# Altium project dv_cm.PrjPcb
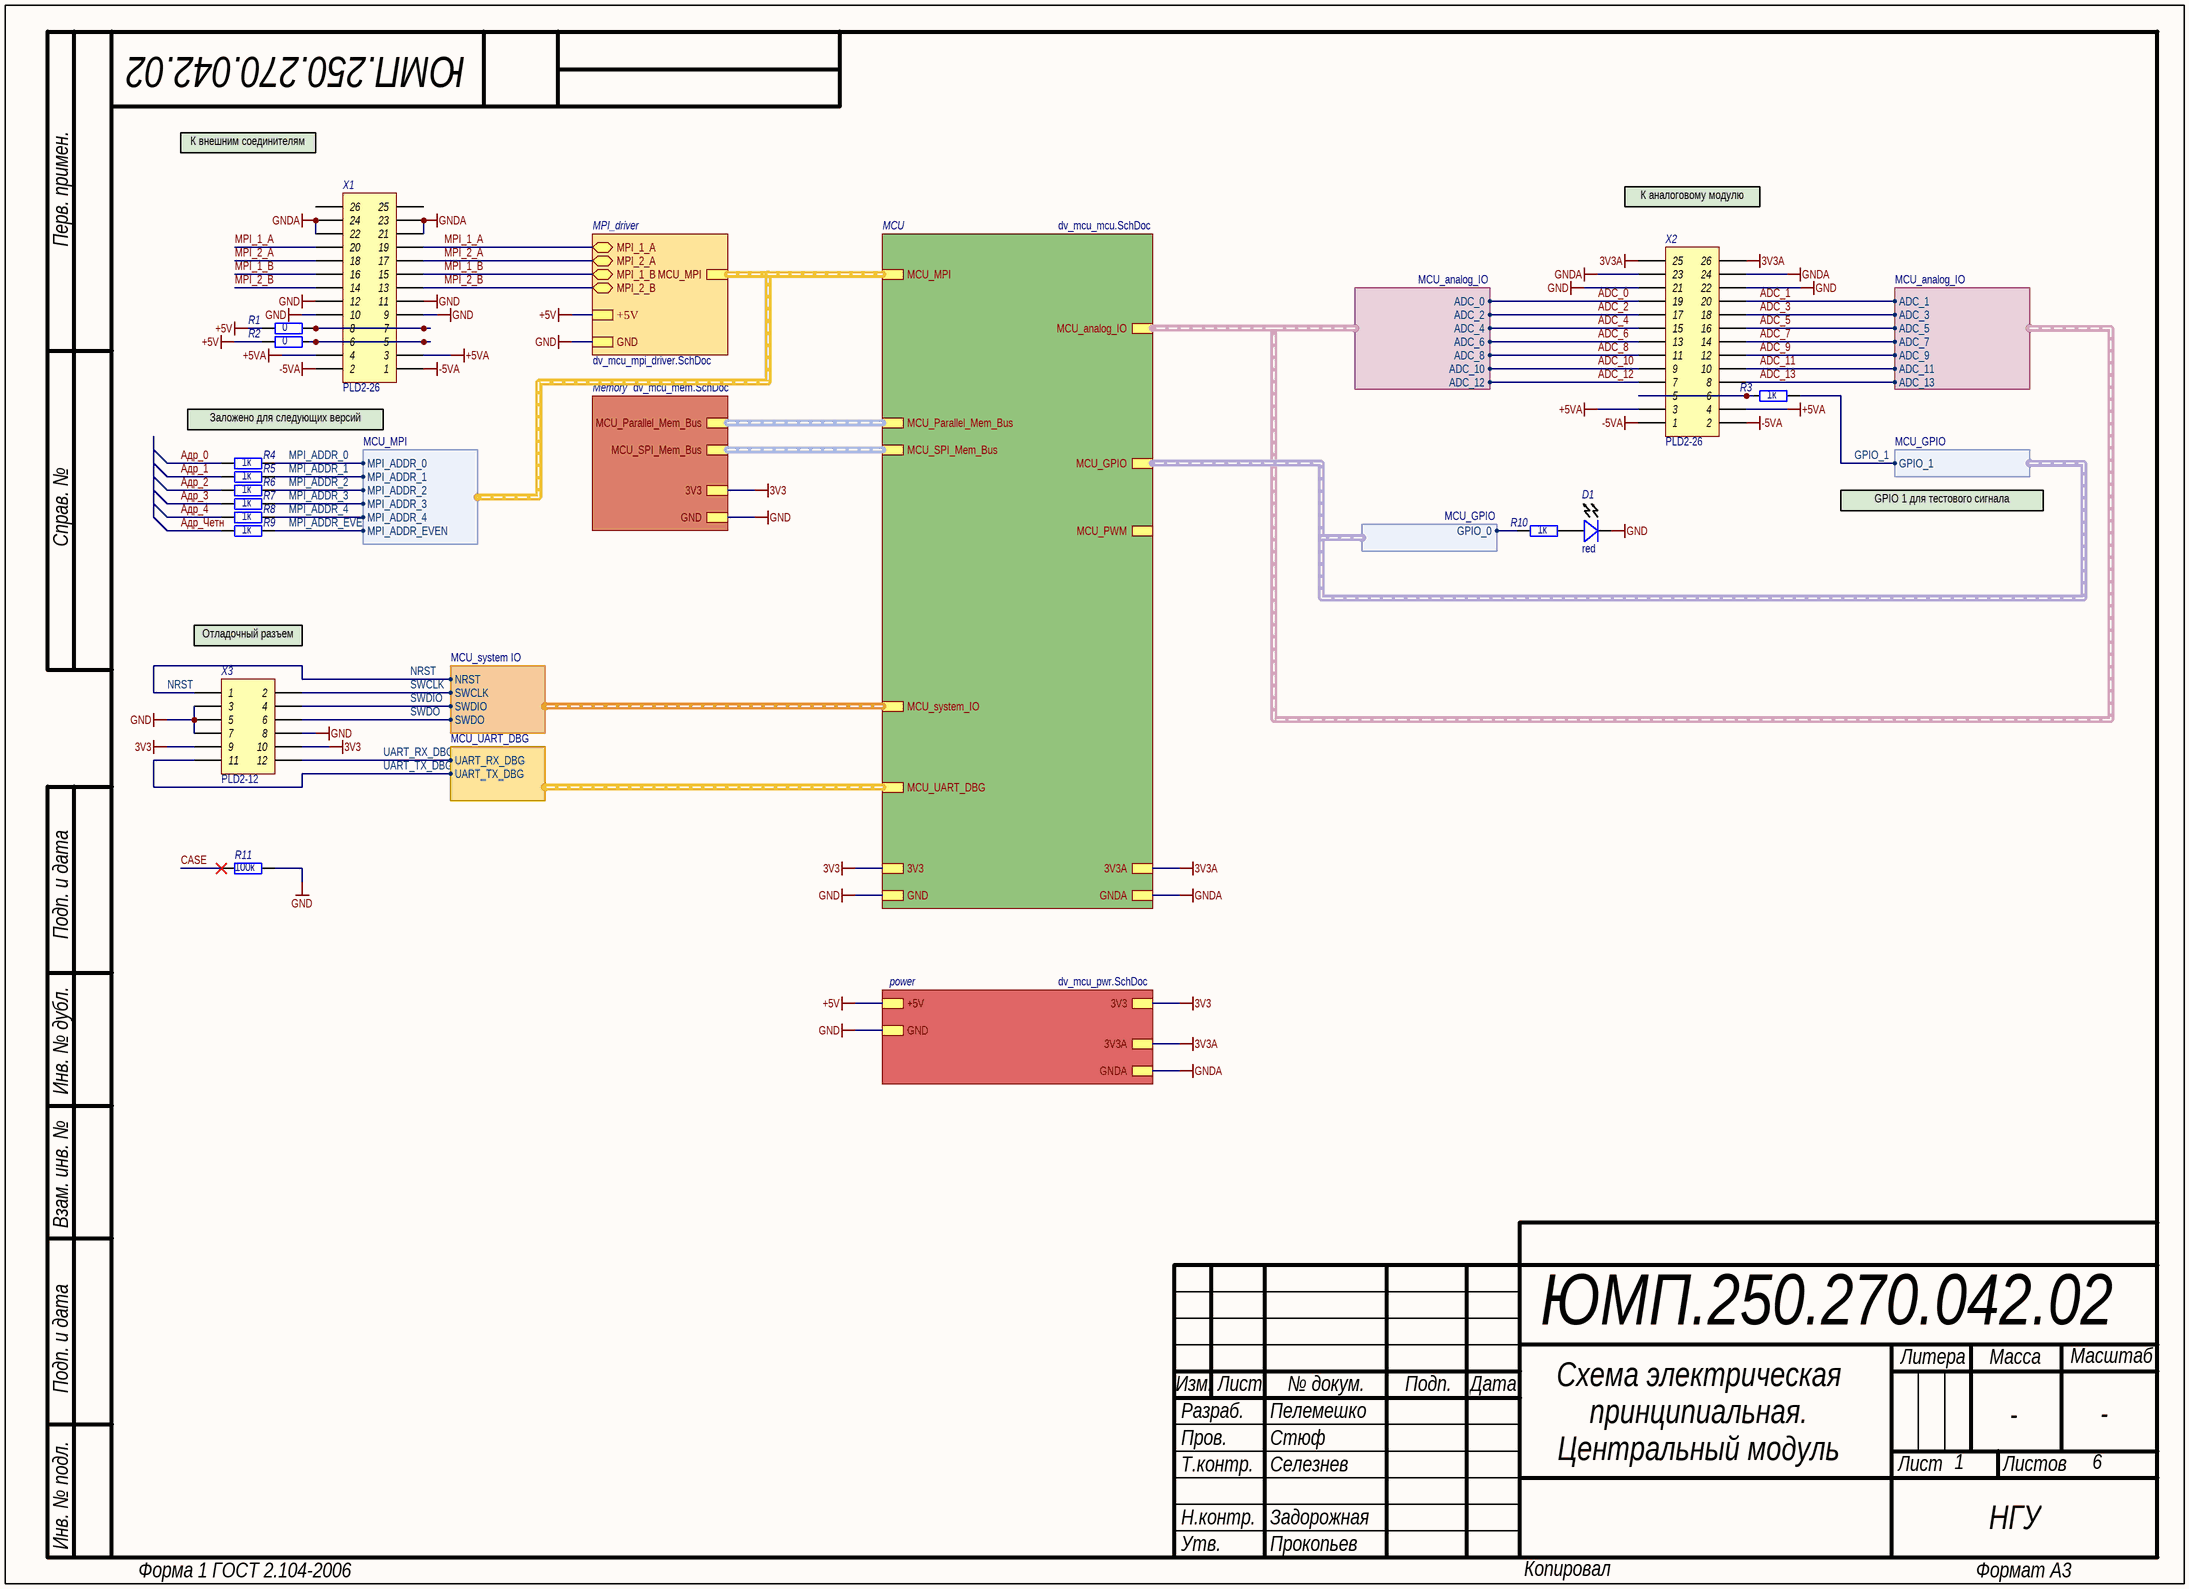
[diagram p0: dv_mcu.SchDoc]
GlobalOrganizationName: НГУ; GlobalProjectName1: Схема электрическая; GlobalProjectName2: принципиальная.; GlobalProjectName3: Центральный модуль; GlobalProjectNumber: ЮМП.250.270.042.02; GlobalProjectRevision: #1.0; Норм.Контр.: Задорожная; Проверил: Стюф; Разработал: Пелемешко; Т.Контр.: Селезнев; Утвердил: Прокопьев
6 sheets, 145 parts. Net scope: hierarchical (ports join the sheet entries above them; power ports are global).
Board file: dv_cm.PcbDoc
Sheets:
  dv_mcu.SchDoc
    MCU = dv_mcu_mcu.SchDoc
      LPF_ADC0 = dv_mcu_analog_lpf.SchDoc
      LPF_ADC1 = dv_mcu_analog_lpf.SchDoc
      LPF_ADC2 = dv_mcu_analog_lpf.SchDoc
      LPF_ADC3 = dv_mcu_analog_lpf.SchDoc
      LPF_ADC4 = dv_mcu_analog_lpf.SchDoc
      LPF_ADC5 = dv_mcu_analog_lpf.SchDoc
      LPF_ADC6 = dv_mcu_analog_lpf.SchDoc
      LPF_ADC7 = dv_mcu_analog_lpf.SchDoc
      LPF_ADC8 = dv_mcu_analog_lpf.SchDoc
      LPF_ADC9 = dv_mcu_analog_lpf.SchDoc
      LPF_ADC10 = dv_mcu_analog_lpf.SchDoc
      LPF_ADC11 = dv_mcu_analog_lpf.SchDoc
      LPF_ADC12 = dv_mcu_analog_lpf.SchDoc
      LPF_ADC13 = dv_mcu_analog_lpf.SchDoc
    Memory = dv_mcu_mem.SchDoc
    MPI_driver = dv_mcu_mpi_driver.SchDoc
    power = dv_mcu_pwr.SchDoc

## Sheet dv_mcu.SchDoc: =GlobalProjectName
size 410 x 297 mm; ApprovedBy: Прокопьев; CheckedBy: Стюф; Author: Пелемешко; Organization: НГУ; DocumentNumber: ЮМП.250.270.042.02 Э3; Revision: #1.0; SheetNumber: 1; SheetTotal: 6; PageSetup: Record=PageOptions|CenterHorizontal=True|CenterVertical=True|PrintScale=1.00|XCorrection=1.00|YCorrection=1.00|PrintKind=1|BorderSize=5000000|LeftOffset=0|BottomOffset=0|Orientation=2|PaperLength=1000|PaperWidth=1000|Scale=100|PaperSource=15|PrintQuality=1200|MediaType=1|DitherType=10|PaperKind=A3|PrintScaleMode=1; Weight: -; ScaleFactor: -; NormInspection: Задорожная; FirstApplication: ЮМП.250.270.042.02

### Parts
D1  value red  [LED-0805]  (hidden comment: LED)
R1  value 0  [SMD_0805]  (hidden comment: OSM R1-12)
R2  value 0  [SMD_0805]  (hidden comment: OSM R1-12)
R3  value 1к  [SMD_0805]  (hidden comment: OSM R1-12)
R4  value 1к  [SMD_0805]  (hidden comment: OSM R1-12)
R5  value 1к  [SMD_0805]  (hidden comment: OSM R1-12)
R6  value 1к  [SMD_0805]  (hidden comment: OSM R1-12)
R7  value 1к  [SMD_0805]  (hidden comment: OSM R1-12)
R8  value 1к  [SMD_0805]  (hidden comment: OSM R1-12)
R9  value 1к  [SMD_0805]  (hidden comment: OSM R1-12)
R10  value 1к  [SMD_0805]  (hidden comment: OSM R1-12)
R11  value 100к  [SMD_0805]  (hidden comment: OSM R1-12)
X1  Наименование: PLD2-26  [SD87340-26]  (hidden comment: Header 2X26)
X2  Наименование: PLD2-26  [SD87340-26]  (hidden comment: Header 2X26)
X3  Header 2X12  [PLD2-12]  (value not drawn)

### Sub-sheets
MCU = dv_mcu_mcu.SchDoc: MCU_GPIO (harness MCU_GPIO), MCU_UART_DBG (harness MCU_UART_DBG), MCU_system_IO (harness MCU_system IO), MCU_Parallel_Mem_Bus (harness MCU_MPI), MCU_MPI (harness MCU_MPI), 3V3, MCU_analog_IO (harness MCU_analog_IO), GND, MCU_SPI_Mem_Bus (harness MCU_SPI_Mem_Bus), MCU_PWM (harness MCU_PWM), 3V3A, GNDA
Memory = dv_mcu_mem.SchDoc: MCU_Parallel_Mem_Bus (harness MCU_MPI), MCU_SPI_Mem_Bus (harness MCU_SPI_Mem_Bus), GND, 3V3
MPI_driver = dv_mcu_mpi_driver.SchDoc: GND, MCU_MPI (harness MCU_MPI), MPI_2_B (bidir), MPI_2_A (bidir), MPI_1_A (bidir), MPI_1_B (bidir), +5V
power = dv_mcu_pwr.SchDoc: 3V3, +5V, 3V3A, GNDA, GND

### Harnesses
MCU_system IO: SWDO, SWDIO, SWCLK, NRST
MCU_UART_DBG: UART_TX_DBG, UART_RX_DBG
MCU_analog_IO: ADC_0, ADC_2, ADC_4, ADC_6, ADC_10, ADC_8, ADC_12
MCU_analog_IO: ADC_1, ADC_3, ADC_5, ADC_7, ADC_11, ADC_9, ADC_13
MCU_MPI: MPI_ADDR_0, MPI_ADDR_1, MPI_ADDR_2, MPI_ADDR_3, MPI_ADDR_4, MPI_ADDR_EVEN
MCU_GPIO: GPIO_1
MCU_GPIO: GPIO_0

### Nets
3V3: X3.9 X3.10 ; sheet MCU/3V3, sheet Memory/3V3, sheet power/3V3
3V3A: X2.25 X2.26 ; sheet MCU/3V3A, sheet power/3V3A
+5V: R1.1 R2.1 ; sheet MPI_driver/+5V, sheet power/+5V
+5VA: X1.3 X1.4 X2.3 X2.4
-5VA: X1.1 X1.2 X2.1 X2.2
GND: D1.2(K) R11.2 X1.9 X1.10 X1.11 X1.12 X1.21 X1.22 X1.23 X1.24 X2.21 X2.22 X2.23 X2.24 X3.3 X3.5 X3.7 X3.8 ; sheet MCU/GND, sheet MCU/GNDA, sheet Memory/GND, sheet MPI_driver/GND, sheet power/GNDA, sheet power/GND  [also labelled GNDA]
ADC_0: X2.19 ; sheet MCU/MCU_analog_IO.ADC_0
ADC_1: X2.20 ; sheet MCU/MCU_analog_IO.ADC_1
ADC_2: X2.17 ; sheet MCU/MCU_analog_IO.ADC_2
ADC_3: X2.18 ; sheet MCU/MCU_analog_IO.ADC_3
ADC_4: X2.15 ; sheet MCU/MCU_analog_IO.ADC_4
ADC_5: X2.16 ; sheet MCU/MCU_analog_IO.ADC_5
ADC_6: X2.13 ; sheet MCU/MCU_analog_IO.ADC_6
ADC_7: X2.14 ; sheet MCU/MCU_analog_IO.ADC_7
ADC_8: X2.11 ; sheet MCU/MCU_analog_IO.ADC_8
ADC_9: X2.12 ; sheet MCU/MCU_analog_IO.ADC_9
ADC_10: X2.9 ; sheet MCU/MCU_analog_IO.ADC_10
ADC_11: X2.10 ; sheet MCU/MCU_analog_IO.ADC_11
ADC_12: X2.7 ; sheet MCU/MCU_analog_IO.ADC_12
ADC_13: X2.8 ; sheet MCU/MCU_analog_IO.ADC_13
CASE: R11.1
GPIO_0: R10.1 ; sheet MCU/MCU_GPIO.GPIO_0
GPIO_1: R3.2 ; sheet MCU/MCU_GPIO.GPIO_1
MPI_1_A: X1.19 X1.20 ; sheet MPI_driver/MPI_1_A
MPI_1_B: X1.15 X1.16 ; sheet MPI_driver/MPI_1_B
MPI_2_A: X1.17 X1.18 ; sheet MPI_driver/MPI_2_A
MPI_2_B: X1.13 X1.14 ; sheet MPI_driver/MPI_2_B
MPI_ADDR_0: R4.2 ; sheet MCU/MCU_MPI.MPI_ADDR_0
MPI_ADDR_1: R5.2 ; sheet MCU/MCU_MPI.MPI_ADDR_1
MPI_ADDR_2: R6.2 ; sheet MCU/MCU_MPI.MPI_ADDR_2
MPI_ADDR_3: R7.2 ; sheet MCU/MCU_MPI.MPI_ADDR_3
MPI_ADDR_4: R8.2 ; sheet MCU/MCU_MPI.MPI_ADDR_4
MPI_ADDR_EVEN: R9.2 ; sheet MCU/MCU_MPI.MPI_ADDR_EVEN
NRST: X3.1 ; sheet MCU/MCU_system_IO.NRST
SWCLK: X3.2 ; sheet MCU/MCU_system_IO.SWCLK
SWDIO: X3.4 ; sheet MCU/MCU_system_IO.SWDIO
SWDO: X3.6 ; sheet MCU/MCU_system_IO.SWDO
UART_RX_DBG: X3.12 ; sheet MCU/MCU_UART_DBG.UART_RX_DBG
UART_TX_DBG: X3.11 ; sheet MCU/MCU_UART_DBG.UART_TX_DBG
Адр_0: R4.1
Адр_1: R5.1
Адр_2: R6.1
Адр_3: R7.1
Адр_4: R8.1
Адр_Четн: R9.1
NetD1_1: D1.1(A) R10.2
NetR1_2: R1.2 X1.7 X1.8
NetR2_2: R2.2 X1.5 X1.6
NetR3_1: R3.1 X2.5 X2.6

Not connected (* = marked no-connect by the designer): X1 25 26

### Buses and harness runs
harness sheet MCU/MCU_MPI = sheet MPI_driver/MCU_MPI
harness sheet MCU/MCU_Parallel_Mem_Bus = sheet Memory/MCU_Parallel_Mem_Bus
harness sheet MCU/MCU_SPI_Mem_Bus = sheet Memory/MCU_SPI_Mem_Bus

### Notes on the sheet
- К внешним соединителям
- К аналоговому модулю
- Заложено для следующих версий
- GPIO 1 для тестового сигнала
- (near X3) Отладочный разъем
- Перв. примен.
- Справ. №
- Подп. и дата
- Инв. № дубл.
- Взам. инв. №
- Изм.
- Разраб.
- Лист
- № докум.
- Подп.
- Дата
- Литера
- Масса
- Масштаб
- Пров.
- Т.контр.
- Листов
- Н.контр.
- Утв.
- Инв. № подл.
- Форма 1 ГОСТ 2.104-2006
- Копировал
- Формат А3

### Library data of the parts
D1 = LED: Назначение: Светодиод; Наименование: SMD-LED; Потребление, Вт: 0,01
R1-R11 = Resistor: Наименование: ОСМ Р1-12; Назначение: SMD-резистор; Потребление, Вт: 0,001; Точность: %
X1 X2 = Header 2X26: Header, 26-Pin, Dual row; Назначение: Header, 20-Pin, Dual row; Потребление, Вт: 0,0
X3 = Header 2X12: Header, 12-Pin, Dual row; Потребление, Вт: 0,0; Назначение: Header, 12-Pin, Dual row; Наименование: PLD2-12

## Sheet dv_mcu_mcu.SchDoc: =GlobalProjectName
size 410 x 297 mm; ApprovedBy: Утвердил; CheckedBy: Проверил; Author: Разработал; Organization: НГУ; DocumentNumber: ЮМП.250.270.042.02 Э3; Revision: #1.0; SheetNumber: 2; SheetTotal: 6; PageSetup: Record=PageOptions|CenterHorizontal=True|CenterVertical=True|PrintScale=1.00|XCorrection=1.00|YCorrection=1.00|PrintKind=1|BorderSize=5000000|LeftOffset=0|BottomOffset=0|Orientation=2|PaperLength=1000|PaperWidth=1000|Scale=100|PaperSource=15|PrintQuality=1200|MediaType=1|DitherType=10|PaperKind=A3|PrintScaleMode=1; Weight: -; ScaleFactor: -; NormInspection: Норм.Контр.; FirstApplication: ЮМП.250.270.042.02; Time: Листов
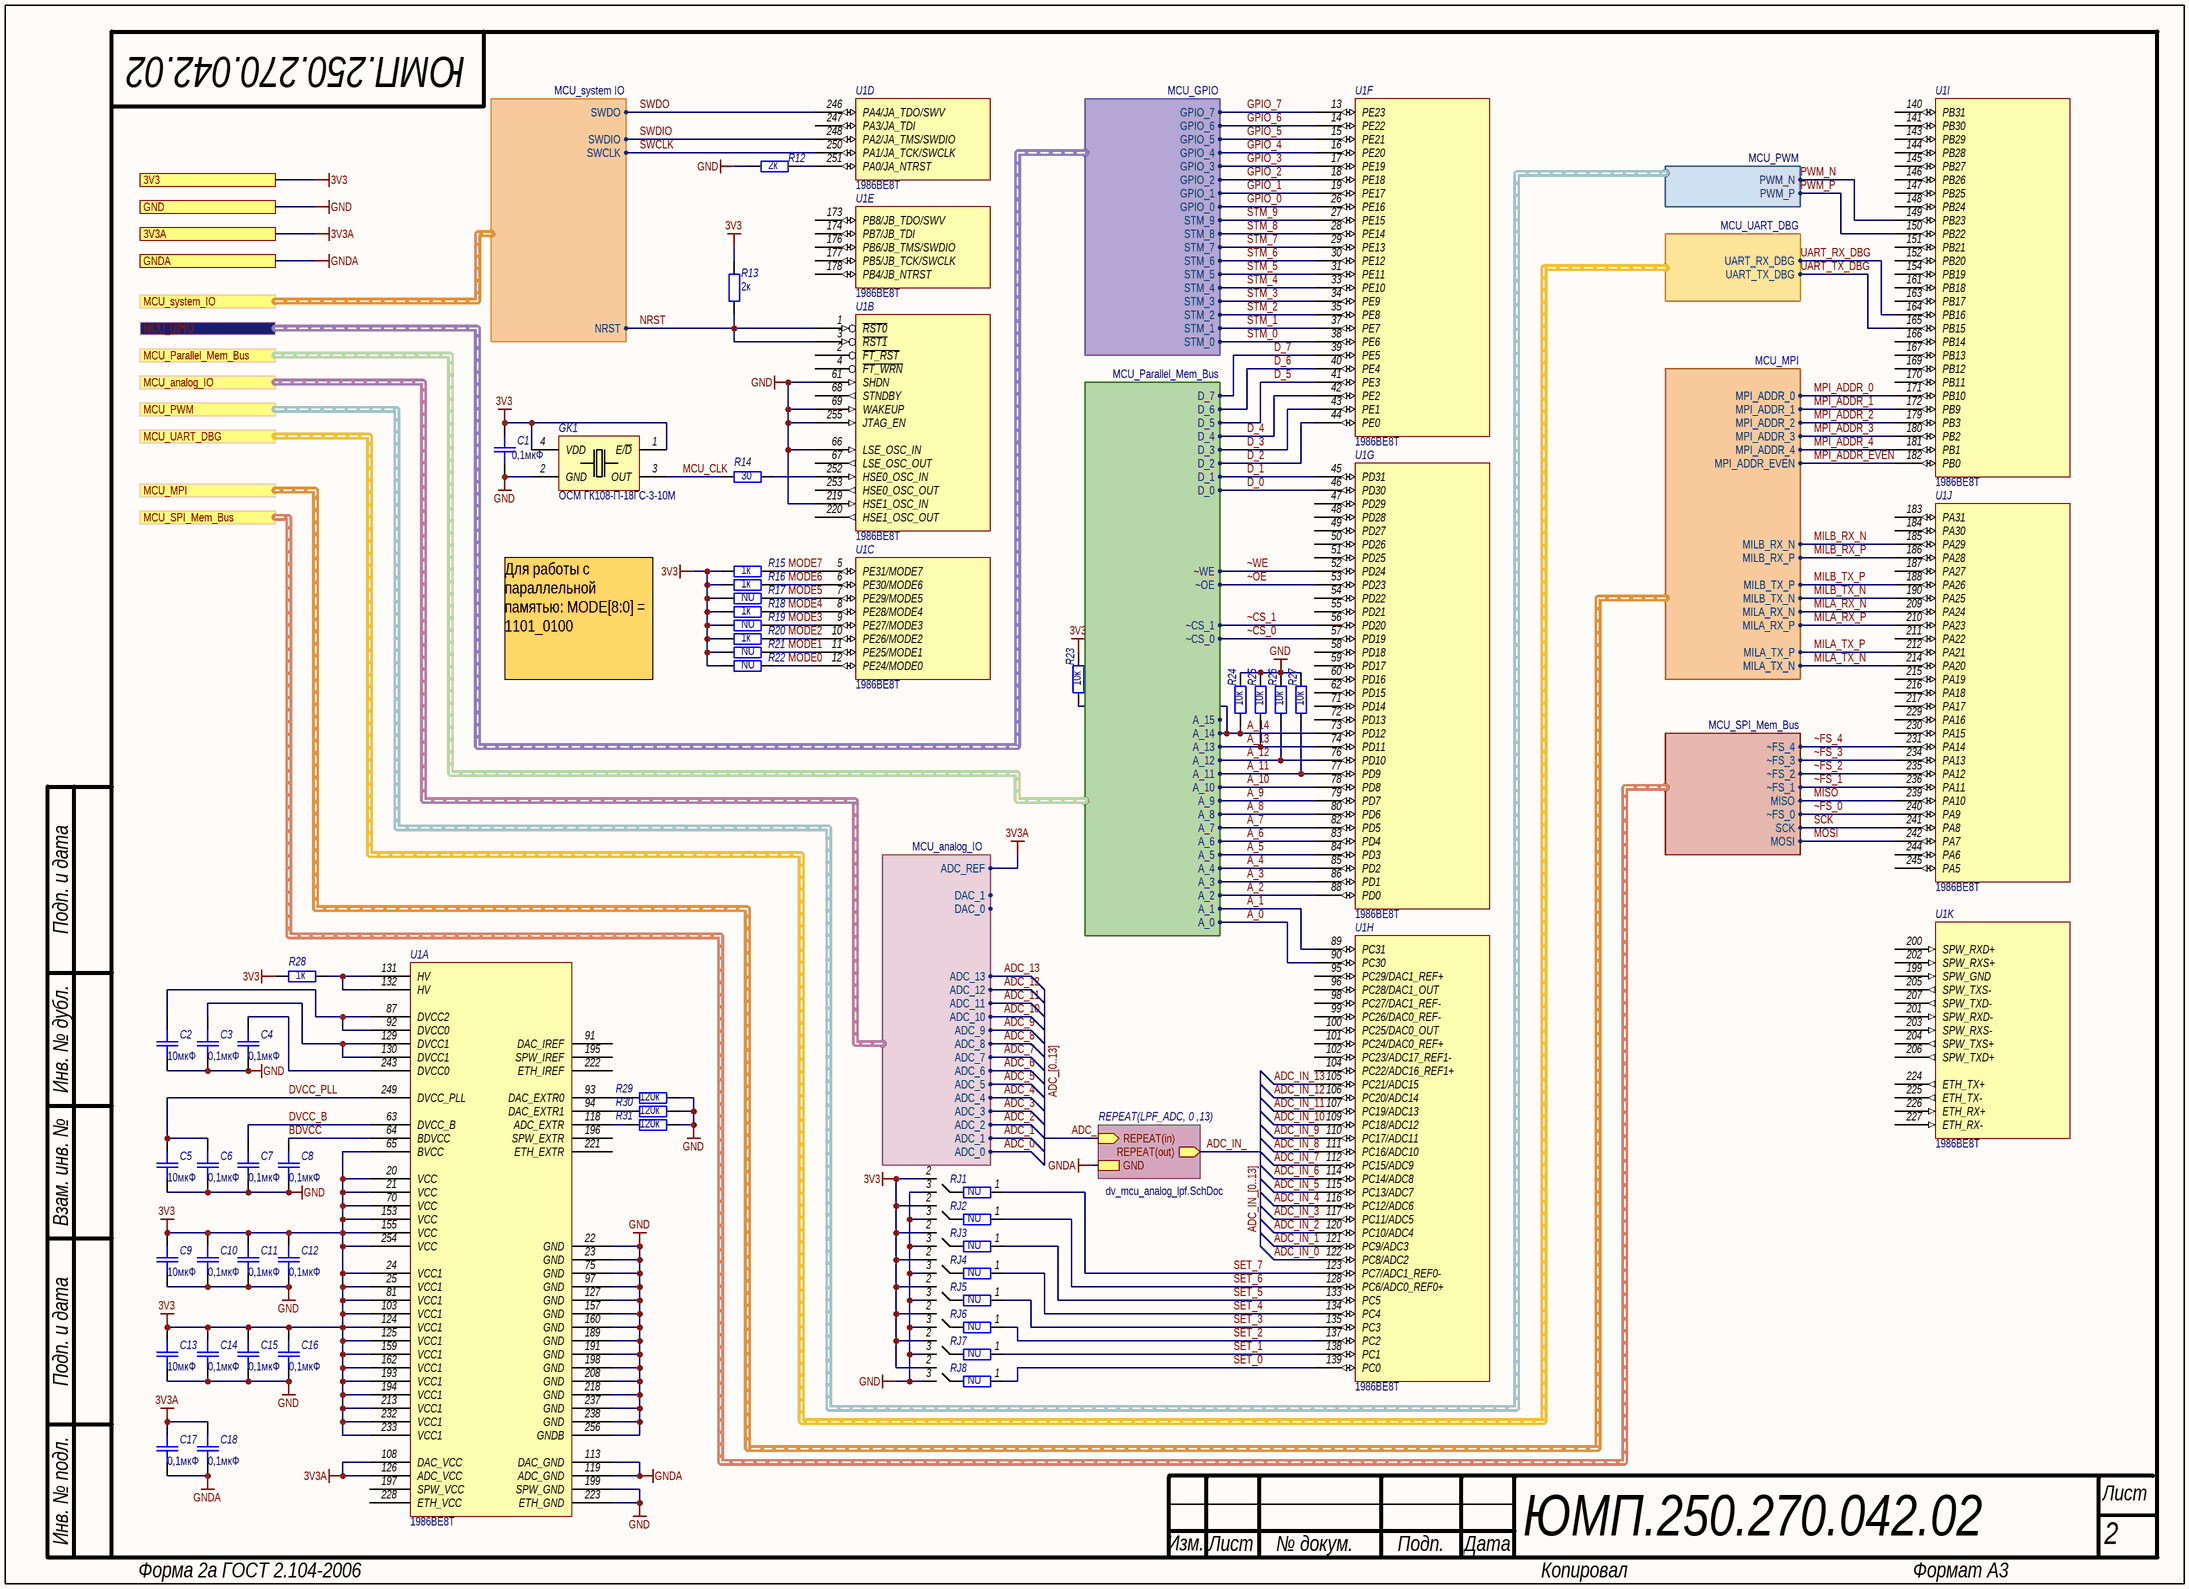
[diagram p1: dv_mcu_mcu.SchDoc]

### Parts
C1  value 0,1мкФ  [SMD_C0805]  (hidden comment: K10-79)
C2  value 10мкФ  [SMD_C0805]  (hidden comment: K10-79)
C3  value 0,1мкФ  [SMD_C0805]  (hidden comment: K10-79)
C4  value 0,1мкФ  [SMD_C0805]  (hidden comment: K10-79)
C5  value 10мкФ  [SMD_C0805]  (hidden comment: K10-79)
C6  value 0,1мкФ  [SMD_C0805]  (hidden comment: K10-79)
C7  value 0,1мкФ  [SMD_C0805]  (hidden comment: K10-79)
C8  value 0,1мкФ  [SMD_C0805]  (hidden comment: K10-79)
C9  value 10мкФ  [SMD_C0805]  (hidden comment: K10-79)
C10  value 0,1мкФ  [SMD_C0805]  (hidden comment: K10-79)
C11  value 0,1мкФ  [SMD_C0805]  (hidden comment: K10-79)
C12  value 0,1мкФ  [SMD_C0805]  (hidden comment: K10-79)
C13  value 10мкФ  [SMD_C0805]  (hidden comment: K10-79)
C14  value 0,1мкФ  [SMD_C0805]  (hidden comment: K10-79)
C15  value 0,1мкФ  [SMD_C0805]  (hidden comment: K10-79)
C16  value 0,1мкФ  [SMD_C0805]  (hidden comment: K10-79)
C17  value 0,1мкФ  [SMD_C0805]  (hidden comment: K10-79)
C18  value 0,1мкФ  [SMD_C0805]  (hidden comment: K10-79)
GK1  Наименование: ОСМ ГК108-П-18ГС-3-10М  [SMD_7050_Crystal_Oscillator]  (hidden comment: GK108)
R12  value 2к  [SMD_0805]  (hidden comment: OSM R1-12)
R13  value 2к  [SMD_0805]  (hidden comment: OSM R1-12)
R14  value 30  [SMD_0805]  (hidden comment: OSM R1-12)
R15  value 1к  [SMD_0805]  (hidden comment: OSM R1-12)
R16  value 1к  [SMD_0805]  (hidden comment: OSM R1-12)
R17  value NU  [SMD_0805]  (hidden comment: OSM R1-12)
R18  value 1к  [SMD_0805]  (hidden comment: OSM R1-12)
R19  value NU  [SMD_0805]  (hidden comment: OSM R1-12)
R20  value 1к  [SMD_0805]  (hidden comment: OSM R1-12)
R21  value NU  [SMD_0805]  (hidden comment: OSM R1-12)
R22  value NU  [SMD_0805]  (hidden comment: OSM R1-12)
R23  value 10к  [SMD_0805]  (hidden comment: OSM R1-12)
R24  value 10к  [SMD_0805]  (hidden comment: OSM R1-12)
R25  value 10к  [SMD_0805]  (hidden comment: OSM R1-12)
R26  value 10к  [SMD_0805]  (hidden comment: OSM R1-12)
R27  value 10к  [SMD_0805]  (hidden comment: OSM R1-12)
R28  value 1к  [SMD_0805]  (hidden comment: OSM R1-12)
R29  value 120к  [SMD_0805]  (hidden comment: OSM R1-12)
R30  value 120к  [SMD_0805]  (hidden comment: OSM R1-12)
R31  value 120к  [SMD_0805]  (hidden comment: OSM R1-12)
RJ1  NU  [SMD_JMP_0402]
RJ2  NU  [SMD_JMP_0402]
RJ3  NU  [SMD_JMP_0402]
RJ4  NU  [SMD_JMP_0402]
RJ5  NU  [SMD_JMP_0402]
RJ6  NU  [SMD_JMP_0402]
RJ7  NU  [SMD_JMP_0402]
RJ8  NU  [SMD_JMP_0402]
U1  1986VE8T  [4244.256-3]  (value not drawn)  (parts A,B,C,D,E,F,G,H,I,J,K of 11)

### Sub-sheets
REPEAT(LPF_ADC, 0 ,13) = dv_mcu_analog_lpf.SchDoc: REPEAT(in) (in), REPEAT(out) (out), GND

### Ports
3V3, 3V3A, GND, GNDA, MCU_analog_IO (harness MCU_analog_IO), MCU_GPIO (harness MCU_GPIO), MCU_MPI (harness MCU_MPI), MCU_Parallel_Mem_Bus (harness MCU_Parallel_Mem_Bus), MCU_PWM (harness MCU_PWM), MCU_SPI_Mem_Bus (harness MCU_SPI_Mem_Bus), MCU_system_IO (harness MCU_system IO), MCU_UART_DBG (harness MCU_UART_DBG)

### Harnesses
MCU_system IO: SWDO, SWDIO, SWCLK, NRST
MCU_analog_IO: ADC_0, ADC_1, ADC_2, ADC_3, ADC_4, ADC_5, ADC_6, ADC_7, ADC_8, ADC_9, DAC_0, DAC_1, ADC_REF, ADC_10, ADC_11, ADC_12, ADC_13
MCU_Parallel_Mem_Bus: D_0, D_7, D_1, D_2, D_3, D_4, D_5, D_6, A_0, ~CS_0, A_1, A_2, A_3, A_4, A_5, A_6, A_7, A_8, A_9, A_10, A_11, A_12, A_13, A_14, A_15, ~OE, ~WE, ~CS_1
MCU_GPIO: GPIO_0, GPIO_1, GPIO_2, GPIO_3, GPIO_4, GPIO_5, GPIO_6, GPIO_7, STM_9, STM_8, STM_7, STM_6, STM_5, STM_4, STM_3, STM_2, STM_1, STM_0
MCU_UART_DBG: UART_TX_DBG, UART_RX_DBG
MCU_MPI: MILB_RX_N, MILB_RX_P, MILB_TX_P, MILB_TX_N, MILA_RX_N, MILA_RX_P, MILA_TX_P, MILA_TX_N, MPI_ADDR_0, MPI_ADDR_1, MPI_ADDR_2, MPI_ADDR_3, MPI_ADDR_4, MPI_ADDR_EVEN
MCU_SPI_Mem_Bus: ~FS_4, MISO, ~FS_0, SCK, MOSI, ~FS_1, ~FS_2, ~FS_3
MCU_PWM: PWM_N, PWM_P

### Nets
3V3: C1.2 C9.2 C10.2 C11.2 C12.2 C13.2 C14.2 C15.2 C16.2 GK1.1(E/~{D}) GK1.4(VDD) R13.2 R15.1 R16.1 R17.1 R18.1 R19.1 R20.1 R21.1 R22.1 R23.2 R28.1 RJ1.2 RJ2.2 RJ3.2 RJ4.2 RJ5.2 RJ6.2 RJ7.2 RJ8.2 U1.20(VCC) U1.21(VCC) U1.24(VCC1) U1.25(VCC1) U1.65(BVCC) U1.70(VCC) U1.81(VCC1) U1.103(VCC1) U1.124(VCC1) U1.125(VCC1) U1.153(VCC) U1.155(VCC) U1.159(VCC1) U1.162(VCC1) U1.193(VCC1) U1.194(VCC1) U1.213(VCC1) U1.232(VCC1) U1.233(VCC1) U1.254(VCC) ; port 3V3
3V3A: C17.2 C18.2 U1.108(DAC_VCC) U1.126(ADC_VCC) ; port 3V3A, port MCU_analog_IO.ADC_REF
GND: C1.1 C2.1 C3.1 C4.1 C5.1 C6.1 C7.1 C8.1 C9.1 C10.1 C11.1 C12.1 C13.1 C14.1 C15.1 C16.1 C17.1 C18.1 GK1.2(GND) R12.1 R24.2 R25.2 R26.2 R27.2 R29.2 R30.2 R31.2 RJ1.3 RJ2.3 RJ3.3 RJ4.3 RJ5.3 RJ6.3 RJ7.3 RJ8.3 U1.22(GND) U1.23(GND) U1.61(SHDN) U1.66(LSE_OSC_IN) U1.69(WAKEUP) U1.75(GND) U1.97(GND) U1.113(DAC_GND) U1.119(ADC_GND) U1.127(GND) U1.157(GND) U1.160(GND) U1.189(GND) U1.191(GND) U1.198(GND) U1.199(SPW_GND) U1.208(GND) U1.218(GND) U1.219(HSE1_OSC_IN) U1.223(ETH_GND) U1.237(GND) U1.238(GND) U1.255(JTAG_EN) U1.256(GNDB) ; port GND, port GNDA, sheet REPEAT(LPF_ADC, 0 ,13)/GND  [also labelled GNDA]
A_0: U1.90(PC30) ; port MCU_Parallel_Mem_Bus.A_0
A_1: U1.89(PC31) ; port MCU_Parallel_Mem_Bus.A_1
A_2: U1.88(PD0) ; port MCU_Parallel_Mem_Bus.A_2
A_3: U1.86(PD1) ; port MCU_Parallel_Mem_Bus.A_3
A_4: U1.85(PD2) ; port MCU_Parallel_Mem_Bus.A_4
A_5: U1.84(PD3) ; port MCU_Parallel_Mem_Bus.A_5
A_6: U1.83(PD4) ; port MCU_Parallel_Mem_Bus.A_6
A_7: U1.82(PD5) ; port MCU_Parallel_Mem_Bus.A_7
A_8: U1.80(PD6) ; port MCU_Parallel_Mem_Bus.A_8
A_9: U1.79(PD7) ; port MCU_Parallel_Mem_Bus.A_9
A_10: U1.78(PD8) ; port MCU_Parallel_Mem_Bus.A_10
A_11: R27.1 U1.77(PD9) ; port MCU_Parallel_Mem_Bus.A_11
A_12: R26.1 U1.76(PD10) ; port MCU_Parallel_Mem_Bus.A_12
A_13: R25.1 U1.74(PD11) ; port MCU_Parallel_Mem_Bus.A_13
A_14: R23.1 R24.1 U1.73(PD12) ; port MCU_Parallel_Mem_Bus.A_14
ADC_: sheet REPEAT(LPF_ADC, 0 ,13)/REPEAT(in)
ADC_IN_: sheet REPEAT(LPF_ADC, 0 ,13)/REPEAT(out)
ADC_IN_0: U1.122(PC8/ADC2)
ADC_IN_1: U1.121(PC9/ADC3)
ADC_IN_2: U1.120(PC10/ADC4)
ADC_IN_3: U1.117(PC11/ADC5)
ADC_IN_4: U1.116(PC12/ADC6)
ADC_IN_5: U1.115(PC13/ADC7)
ADC_IN_6: U1.114(PC14/ADC8)
ADC_IN_7: U1.112(PC15/ADC9)
ADC_IN_8: U1.111(PC16/ADC10)
ADC_IN_9: U1.110(PC17/ADC11)
ADC_IN_10: U1.109(PC18/ADC12)
ADC_IN_11: U1.107(PC19/ADC13)
ADC_IN_12: U1.106(PC20/ADC14)
ADC_IN_13: U1.105(PC21/ADC15)
BDVCC: C8.2 U1.64(BDVCC)
D_0: U1.46(PD30) ; port MCU_Parallel_Mem_Bus.D_0
D_1: U1.45(PD31) ; port MCU_Parallel_Mem_Bus.D_1
D_2: U1.44(PE0) ; port MCU_Parallel_Mem_Bus.D_2
D_3: U1.43(PE1) ; port MCU_Parallel_Mem_Bus.D_3
D_4: U1.42(PE2) ; port MCU_Parallel_Mem_Bus.D_4
D_5: U1.41(PE3) ; port MCU_Parallel_Mem_Bus.D_5
D_6: U1.40(PE4) ; port MCU_Parallel_Mem_Bus.D_6
D_7: U1.39(PE5) ; port MCU_Parallel_Mem_Bus.D_7
DVCC_B: C7.2 U1.63(DVCC_B)
DVCC_PLL: C5.2 C6.2 U1.249(DVCC_PLL)
GPIO_0: U1.26(PE16) ; port MCU_GPIO.GPIO_0
GPIO_1: U1.19(PE17) ; port MCU_GPIO.GPIO_1
GPIO_2: U1.18(PE18) ; port MCU_GPIO.GPIO_2
GPIO_3: U1.17(PE19) ; port MCU_GPIO.GPIO_3
GPIO_4: U1.16(PE20) ; port MCU_GPIO.GPIO_4
GPIO_5: U1.15(PE21) ; port MCU_GPIO.GPIO_5
GPIO_6: U1.14(PE22) ; port MCU_GPIO.GPIO_6
GPIO_7: U1.13(PE23) ; port MCU_GPIO.GPIO_7
MCU_CLK: GK1.3(OUT) R14.1
MILA_RX_N: U1.209(PA24) ; port MCU_MPI.MILA_RX_N
MILA_RX_P: U1.210(PA23) ; port MCU_MPI.MILA_RX_P
MILA_TX_N: U1.214(PA20) ; port MCU_MPI.MILA_TX_N
MILA_TX_P: U1.212(PA21) ; port MCU_MPI.MILA_TX_P
MILB_RX_N: U1.185(PA29) ; port MCU_MPI.MILB_RX_N
MILB_RX_P: U1.186(PA28) ; port MCU_MPI.MILB_RX_P
MILB_TX_N: U1.190(PA25) ; port MCU_MPI.MILB_TX_N
MILB_TX_P: U1.188(PA26) ; port MCU_MPI.MILB_TX_P
MISO: U1.239(PA10) ; port MCU_SPI_Mem_Bus.MISO
MODE0: R22.2 U1.12(PE24/MODE0)
MODE1: R21.2 U1.11(PE25/MODE1)
MODE2: R20.2 U1.10(PE26/MODE2)
MODE3: R19.2 U1.9(PE27/MODE3)
MODE4: R18.2 U1.8(PE28/MODE4)
MODE5: R17.2 U1.7(PE29/MODE5)
MODE6: R16.2 U1.6(PE30/MODE6)
MODE7: R15.2 U1.5(PE31/MODE7)
MOSI: U1.242(PA7) ; port MCU_SPI_Mem_Bus.MOSI
MPI_ADDR_0: U1.171(PB10) ; port MCU_MPI.MPI_ADDR_0
MPI_ADDR_1: U1.172(PB9) ; port MCU_MPI.MPI_ADDR_1
MPI_ADDR_2: U1.179(PB3) ; port MCU_MPI.MPI_ADDR_2
MPI_ADDR_3: U1.180(PB2) ; port MCU_MPI.MPI_ADDR_3
MPI_ADDR_4: U1.181(PB1) ; port MCU_MPI.MPI_ADDR_4
MPI_ADDR_EVEN: U1.182(PB0) ; port MCU_MPI.MPI_ADDR_EVEN
NRST: R13.1 U1.1(~{RST0}) U1.3(~{RST1}) ; port MCU_system_IO.NRST
PWM_N: U1.149(PB23) ; port MCU_PWM.PWM_N
PWM_P: U1.150(PB22) ; port MCU_PWM.PWM_P
SCK: U1.241(PA8) ; port MCU_SPI_Mem_Bus.SCK
SET_0: RJ8.1 U1.139(PC0)
SET_1: RJ7.1 U1.138(PC1)
SET_2: RJ6.1 U1.137(PC2)
SET_3: RJ5.1 U1.135(PC3)
SET_4: RJ4.1 U1.134(PC4)
SET_5: RJ3.1 U1.133(PC5)
SET_6: RJ2.1 U1.128(PC6/ADC0_REF0+)
SET_7: RJ1.1 U1.123(PC7/ADC1_REF0-)
STM_0: U1.38(PE6) ; port MCU_GPIO.STM_0
STM_1: U1.37(PE7) ; port MCU_GPIO.STM_1
STM_2: U1.35(PE8) ; port MCU_GPIO.STM_2
STM_3: U1.34(PE9) ; port MCU_GPIO.STM_3
STM_4: U1.33(PE10) ; port MCU_GPIO.STM_4
STM_5: U1.31(PE11) ; port MCU_GPIO.STM_5
STM_6: U1.30(PE12) ; port MCU_GPIO.STM_6
STM_7: U1.29(PE13) ; port MCU_GPIO.STM_7
STM_8: U1.28(PE14) ; port MCU_GPIO.STM_8
STM_9: U1.27(PE15) ; port MCU_GPIO.STM_9
SWCLK: U1.250(PA1/JA_TCK/SWCLK) ; port MCU_system_IO.SWCLK
SWDIO: U1.248(PA2/JA_TMS/SWDIO) ; port MCU_system_IO.SWDIO
SWDO: U1.246(PA4/JA_TDO/SWV) ; port MCU_system_IO.SWDO
UART_RX_DBG: U1.164(PB16) ; port MCU_UART_DBG.UART_RX_DBG
UART_TX_DBG: U1.165(PB15) ; port MCU_UART_DBG.UART_TX_DBG
~CS_0: U1.57(PD19) ; port MCU_Parallel_Mem_Bus.~CS_0
~CS_1: U1.56(PD20) ; port MCU_Parallel_Mem_Bus.~CS_1
~FS_0: U1.240(PA9) ; port MCU_SPI_Mem_Bus.~FS_0
~FS_1: U1.236(PA11) ; port MCU_SPI_Mem_Bus.~FS_1
~FS_2: U1.235(PA12) ; port MCU_SPI_Mem_Bus.~FS_2
~FS_3: U1.234(PA13) ; port MCU_SPI_Mem_Bus.~FS_3
~FS_4: U1.231(PA14) ; port MCU_SPI_Mem_Bus.~FS_4
~OE: U1.53(PD23) ; port MCU_Parallel_Mem_Bus.~OE
~WE: U1.52(PD24) ; port MCU_Parallel_Mem_Bus.~WE
NetC2_2: C2.2 U1.87(DVCC2) U1.92(DVCC0)
NetC3_2: C3.2 U1.129(DVCC1) U1.130(DVCC1)
NetC4_2: C4.2 U1.243(DVCC0)
NetR12_2: R12.2 U1.251(PA0/JA_NTRST)
NetR14_2: R14.2 U1.252(HSE0_OSC_IN)
NetR28_2: R28.2 U1.131(HV) U1.132(HV)
NetR29_1: R29.1 U1.93(DAC_EXTR0)
NetR30_1: R30.1 U1.94(DAC_EXTR1)
NetR31_1: R31.1 U1.118(ADC_EXTR)

Not connected (* = marked no-connect by the designer): U1 2(~{FT_RST}) 4(~{FT_WRN}) 47(PD29) 48(PD28) 49(PD27) 50(PD26) 51(PD25) 54(PD22) 55(PD21) 58(PD18) 59(PD17) 60(PD16) 62(PD15) 67(LSE_OSC_OUT) 68(STNDBY) 71(PD14) 72(PD13) 91(DAC_IREF) 95(PC29/DAC1_REF+) 96(PC28/DAC1_OUT) 98(PC27/DAC1_REF-) 99(PC26/DAC0_REF-) 100(PC25/DAC0_OUT) 101(PC24/DAC0_REF+) 102(PC23/ADC17_REF1-) 104(PC22/ADC16_REF1+) 140(PB31) 141(PB30) 143(PB29) 144(PB28) 145(PB27) 146(PB26) 147(PB25) 148(PB24) 151(PB21) 152(PB20) 154(PB19) 161(PB18) 163(PB17) 166(PB14) 167(PB13) 169(PB12) 170(PB11) 173(PB8/JB_TDO/SWV) 174(PB7/JB_TDI) 176(PB6/JB_TMS/SWDIO) 177(PB5/JB_TCK/SWCLK) 178(PB4/JB_NTRST) 183(PA31) 184(PA30) 187(PA27) 195(SPW_IREF) 196(SPW_EXTR) 197(SPW_VCC) 200(SPW_RXD+) 201(SPW_RXD-) 202(SPW_RXS+) 203(SPW_RXS-) 204(SPW_TXS+) 205(SPW_TXS-) 206(SPW_TXD+) 207(SPW_TXD-) 211(PA22) 215(PA19) 216(PA18) 217(PA17) 220(HSE1_OSC_OUT) 221(ETH_EXTR) 222(ETH_IREF) 224(ETH_TX+) 225(ETH_TX-) 226(ETH_RX+) 227(ETH_RX-) 228(ETH_VCC) 229(PA16) 230(PA15) 244(PA6) 245(PA5) 247(PA3/JA_TDI) 253(HSE0_OSC_OUT)

### Buses and harness runs
bus ADC_[0..13]
bus ADC_IN_[0..13]

### Notes on the sheet
- Для работы с параллельной памятью: MODE[8:0] = 1101_0100
- Подп. и дата
- Инв. № дубл.
- Взам. инв. №
- Инв. № подл.
- Изм.
- Лист
- № докум.
- Подп.
- Дата
- Форма 2а ГОСТ 2.104-2006
- Копировал
- Формат А3

### Library data of the parts
C1-C18 = Capacitor: Назначение: SMD-конденсатор; Наименование: К10-79; Потребление, Вт: 0; Напряжение: В; Точность: %
GK1 = Crystal_Oscillator: Crystall oscillator, CMOS, 3.3V, SMD7050; Назначение: Кварцевый генератор; Потребление, Вт: 0,165; ComponentLink1Description: DataSheet; ComponentLink1URL: http://www.lit-phonon.ru/downloads/GK108-P.pdf
R12-R31 = Resistor: as R1 on sheet dv_mcu
RJ1-RJ8 = Resistor_Jamper: Resistor-Jumper; Назначение: Резистор для выбора режима; Наименование: Р1-12-0.125 ОСМ; Потребление, Вт: 0,0; Value: NU
U1 = 1986BE8T: ARM CortexM4F микроконтроллер; Назначение: АРМ микроконтроллер; Потребление, Вт: *; ComponentLink1Description: DataSheet; ComponentLink1URL: https://ic.milandr.ru/upload/iblock/62c/62ca58d6ede1a3e06d56be1e19dbdbc8.pdf; ComponentLink2Description: Errata; ComponentLink2URL: https://ic.milandr.ru/upload/iblock/379/379105061a67e6dd9373b458eff4ec3a.pdf; Наименование: 1986BE8T

## Sheet dv_mcu_analog_lpf.SchDoc: =GlobalProjectName
size 209 x 297 mm; ApprovedBy: Утвердил; CheckedBy: Проверил; Author: Разработал; Organization: НГУ; DocumentNumber: ЮМП.250.270.042.02 Э3; Revision: #1.0; SheetNumber: 3; SheetTotal: 6; PageSetup: Record=PageOptions|CenterHorizontal=True|CenterVertical=True|PrintScale=1.00|XCorrection=1.00|YCorrection=1.00|PrintKind=1|BorderSize=5000000|LeftOffset=0|BottomOffset=0|Orientation=2|PaperLength=1000|PaperWidth=1000|Scale=100|PaperSource=15|PrintQuality=1200|MediaType=1|DitherType=10|PaperKind=A3|PrintScaleMode=1; Weight: -; ScaleFactor: -; NormInspection: Норм.Контр.; FirstApplication: ЮМП.250.270.042.02
Used 14 times, as channels MCU/LPF_ADC0, MCU/LPF_ADC1, MCU/LPF_ADC2, MCU/LPF_ADC3, MCU/LPF_ADC4, MCU/LPF_ADC5, MCU/LPF_ADC6, MCU/LPF_ADC7, MCU/LPF_ADC8, MCU/LPF_ADC9, MCU/LPF_ADC10, MCU/LPF_ADC11, MCU/LPF_ADC12, MCU/LPF_ADC13. Parts and nets are listed once, with the designators drawn on the sheet.
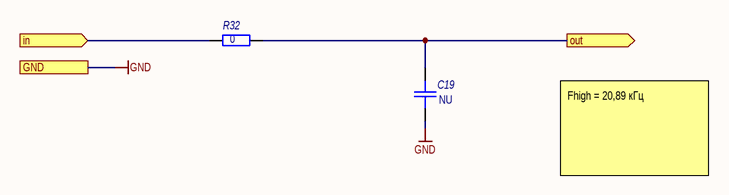
[diagram p2: dv_mcu_analog_lpf.SchDoc]

### Parts
C19  value NU  [SMD_C0805]  (hidden comment: K10-79)
R32  value 0  [SMD_0805]  (hidden comment: OSM R1-12)

### Ports
GND, in (in), out (out)

### Nets
GND: C19.1 ; port GND
in: R32.1 ; port in
out: C19.2 R32.2 ; port out

### Channels
MCU/LPF_ADC0: designators end in _LPF_ADC0; ports GND=GND in=ADC_0 out=ADC_IN_0
MCU/LPF_ADC1: designators end in _LPF_ADC1; ports GND=GND in=ADC_1 out=ADC_IN_1
MCU/LPF_ADC2: designators end in _LPF_ADC2; ports GND=GND in=ADC_2 out=ADC_IN_2
MCU/LPF_ADC3: designators end in _LPF_ADC3; ports GND=GND in=ADC_3 out=ADC_IN_3
MCU/LPF_ADC4: designators end in _LPF_ADC4; ports GND=GND in=ADC_4 out=ADC_IN_4
MCU/LPF_ADC5: designators end in _LPF_ADC5; ports GND=GND in=ADC_5 out=ADC_IN_5
MCU/LPF_ADC6: designators end in _LPF_ADC6; ports GND=GND in=ADC_6 out=ADC_IN_6
MCU/LPF_ADC7: designators end in _LPF_ADC7; ports GND=GND in=ADC_7 out=ADC_IN_7
MCU/LPF_ADC8: designators end in _LPF_ADC8; ports GND=GND in=ADC_8 out=ADC_IN_8
MCU/LPF_ADC9: designators end in _LPF_ADC9; ports GND=GND in=ADC_9 out=ADC_IN_9
MCU/LPF_ADC10: designators end in _LPF_ADC10; ports GND=GND in=ADC_10 out=ADC_IN_10
MCU/LPF_ADC11: designators end in _LPF_ADC11; ports GND=GND in=ADC_11 out=ADC_IN_11
MCU/LPF_ADC12: designators end in _LPF_ADC12; ports GND=GND in=ADC_12 out=ADC_IN_12
MCU/LPF_ADC13: designators end in _LPF_ADC13; ports GND=GND in=ADC_13 out=ADC_IN_13

### Notes on the sheet
- Fhigh = 20,89 кГц
- Подп. и дата
- Инв. № дубл.
- Взам. инв. №
- Инв. № подл.
- Изм.
- Лист
- № докум.
- Подп.
- Дата
- Форма 2а ГОСТ 2.104-2006
- Копировал
- Формат А4

### Library data of the parts
C19 = Capacitor: as C1 on sheet dv_mcu_mcu
R32 = Resistor: as R1 on sheet dv_mcu

## Sheet dv_mcu_mem.SchDoc: =GlobalProjectName
size 209 x 297 mm; ApprovedBy: Утвердил; CheckedBy: Проверил; Author: Разработал; Organization: НГУ; DocumentNumber: ЮМП.250.270.042.02 Э3; Revision: #1.0; SheetNumber: 4; SheetTotal: 6; PageSetup: Record=PageOptions|CenterHorizontal=True|CenterVertical=True|PrintScale=1.00|XCorrection=1.00|YCorrection=1.00|PrintKind=1|BorderSize=5000000|LeftOffset=0|BottomOffset=0|Orientation=2|PaperLength=1000|PaperWidth=1000|Scale=100|PaperSource=15|PrintQuality=1200|MediaType=1|DitherType=10|PaperKind=A3|PrintScaleMode=1; Weight: -; ScaleFactor: -; NormInspection: Норм.Контр.; FirstApplication: ЮМП.250.270.042.02
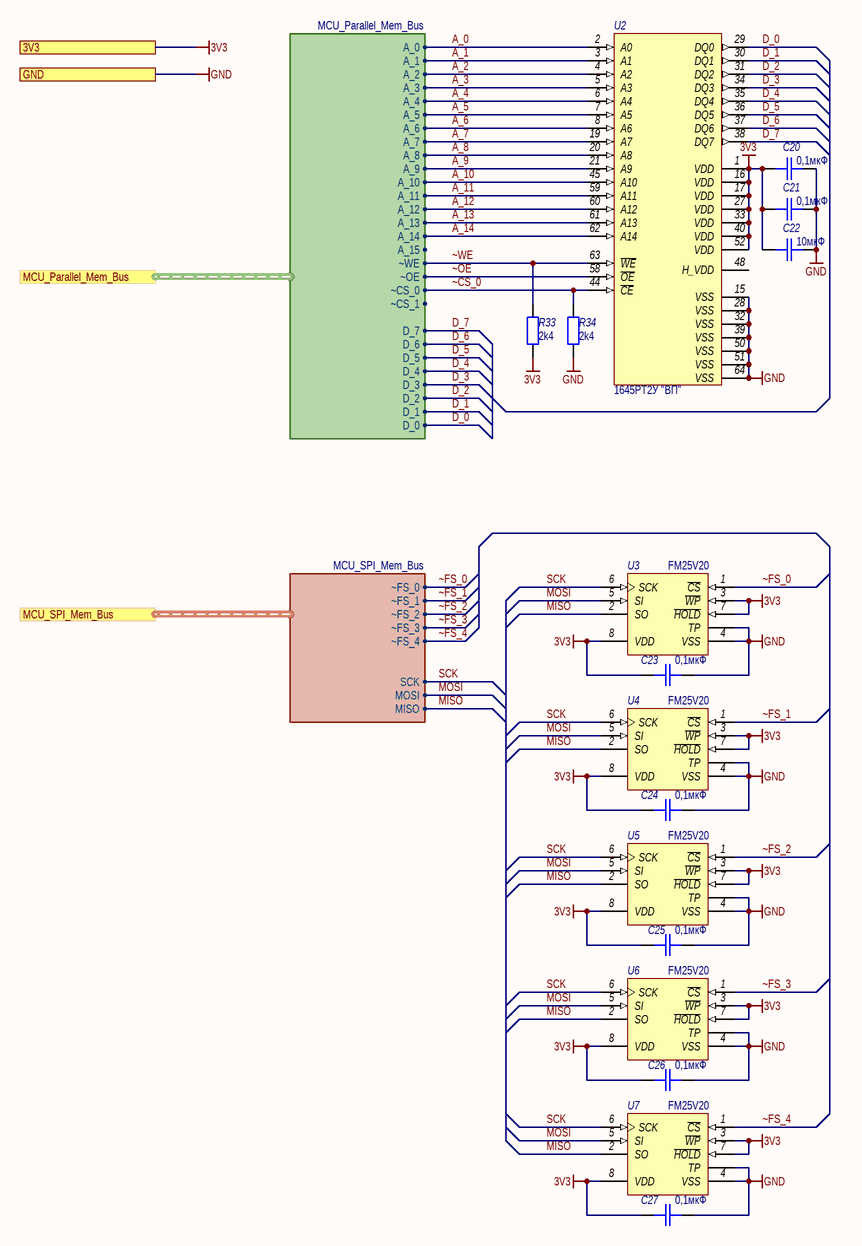
[diagram p3: dv_mcu_mem.SchDoc]

### Parts
C20  value 0,1мкФ  [SMD_C0805]  (hidden comment: K10-79)
C21  value 0,1мкФ  [SMD_C0805]  (hidden comment: K10-79)
C22  value 10мкФ  [SMD_C0805]  (hidden comment: K10-79)
C23  value 0,1мкФ  [SMD_C0805]  (hidden comment: K10-79)
C24  value 0,1мкФ  [SMD_C0805]  (hidden comment: K10-79)
C25  value 0,1мкФ  [SMD_C0805]  (hidden comment: K10-79)
C26  value 0,1мкФ  [SMD_C0805]  (hidden comment: K10-79)
C27  value 0,1мкФ  [SMD_C0805]  (hidden comment: K10-79)
R33  value 2k4  [SMD_0805]  (hidden comment: OSM R1-12)
R34  value 2k4  [SMD_0805]  (hidden comment: OSM R1-12)
U2  Наименование: 1645РТ2У "ВП"  [5134.64-6]  (hidden comment: 1645RT2U VP)
U3  FM25V20  [TDFN-8_6x5]
U4  FM25V20  [TDFN-8_6x5]
U5  FM25V20  [TDFN-8_6x5]
U6  FM25V20  [TDFN-8_6x5]
U7  FM25V20  [TDFN-8_6x5]

### Ports
3V3, GND, MCU_Parallel_Mem_Bus (harness MCU_Parallel_Mem_Bus), MCU_SPI_Mem_Bus (harness MCU_SPI_Mem_Bus)

### Harnesses
MCU_Parallel_Mem_Bus: D_0, ~CS_0, ~OE, ~WE, ~CS_1, D_1, D_2, D_7, D_3, D_4, D_5, D_6, A_0, A_1, A_2, A_3, A_4, A_5, A_6, A_7, A_8, A_9, A_10, A_11, A_12, A_13, A_14, A_15
MCU_SPI_Mem_Bus: ~FS_4, MISO, ~FS_0, SCK, MOSI, ~FS_1, ~FS_2, ~FS_3

### Nets
3V3: C20.1 C21.1 C22.2 C23.2 C24.2 C25.2 C26.2 C27.2 R33.1 U2.1(VDD) U2.16(VDD) U2.17(VDD) U2.27(VDD) U2.33(VDD) U2.40(VDD) U2.52(VDD) U3.3(~{WP}) U3.7(~{HOLD}) U3.8(VDD) U4.3(~{WP}) U4.7(~{HOLD}) U4.8(VDD) U5.3(~{WP}) U5.7(~{HOLD}) U5.8(VDD) U6.3(~{WP}) U6.7(~{HOLD}) U6.8(VDD) U7.3(~{WP}) U7.7(~{HOLD}) U7.8(VDD) ; port 3V3
GND: C20.2 C21.2 C22.1 C23.1 C24.1 C25.1 C26.1 C27.1 R34.1 U2.15(VSS) U2.28(VSS) U2.32(VSS) U2.39(VSS) U2.50(VSS) U2.51(VSS) U2.64(VSS) U3.4(VSS) U3.TP U4.4(VSS) U4.TP U5.4(VSS) U5.TP U6.4(VSS) U6.TP U7.4(VSS) U7.TP ; port GND
A_0: U2.2(A0) ; port MCU_Parallel_Mem_Bus.A_0
A_1: U2.3(A1) ; port MCU_Parallel_Mem_Bus.A_1
A_2: U2.4(A2) ; port MCU_Parallel_Mem_Bus.A_2
A_3: U2.5(A3) ; port MCU_Parallel_Mem_Bus.A_3
A_4: U2.6(A4) ; port MCU_Parallel_Mem_Bus.A_4
A_5: U2.7(A5) ; port MCU_Parallel_Mem_Bus.A_5
A_6: U2.8(A6) ; port MCU_Parallel_Mem_Bus.A_6
A_7: U2.19(A7) ; port MCU_Parallel_Mem_Bus.A_7
A_8: U2.20(A8) ; port MCU_Parallel_Mem_Bus.A_8
A_9: U2.21(A9) ; port MCU_Parallel_Mem_Bus.A_9
A_10: U2.45(A10) ; port MCU_Parallel_Mem_Bus.A_10
A_11: U2.59(A11) ; port MCU_Parallel_Mem_Bus.A_11
A_12: U2.60(A12) ; port MCU_Parallel_Mem_Bus.A_12
A_13: U2.61(A13) ; port MCU_Parallel_Mem_Bus.A_13
A_14: U2.62(A14) ; port MCU_Parallel_Mem_Bus.A_14
D_0: U2.29(DQ0) ; port MCU_Parallel_Mem_Bus.D_0
D_1: U2.30(DQ1) ; port MCU_Parallel_Mem_Bus.D_1
D_2: U2.31(DQ2) ; port MCU_Parallel_Mem_Bus.D_2
D_3: U2.34(DQ3) ; port MCU_Parallel_Mem_Bus.D_3
D_4: U2.35(DQ4) ; port MCU_Parallel_Mem_Bus.D_4
D_5: U2.36(DQ5) ; port MCU_Parallel_Mem_Bus.D_5
D_6: U2.37(DQ6) ; port MCU_Parallel_Mem_Bus.D_6
D_7: U2.38(DQ7) ; port MCU_Parallel_Mem_Bus.D_7
MISO: U3.2(SO) U4.2(SO) U5.2(SO) U6.2(SO) U7.2(SO) ; port MCU_SPI_Mem_Bus.MISO
MOSI: U3.5(SI) U4.5(SI) U5.5(SI) U6.5(SI) U7.5(SI) ; port MCU_SPI_Mem_Bus.MOSI
SCK: U3.6(SCK) U4.6(SCK) U5.6(SCK) U6.6(SCK) U7.6(SCK) ; port MCU_SPI_Mem_Bus.SCK
~CS_0: R34.2 U2.44(~{CE}) ; port MCU_Parallel_Mem_Bus.~CS_0
~FS_0: U3.1(~{CS}) ; port MCU_SPI_Mem_Bus.~FS_0
~FS_1: U4.1(~{CS}) ; port MCU_SPI_Mem_Bus.~FS_1
~FS_2: U5.1(~{CS}) ; port MCU_SPI_Mem_Bus.~FS_2
~FS_3: U6.1(~{CS}) ; port MCU_SPI_Mem_Bus.~FS_3
~FS_4: U7.1(~{CS}) ; port MCU_SPI_Mem_Bus.~FS_4
~OE: U2.58(~{OE}) ; port MCU_Parallel_Mem_Bus.~OE
~WE: R33.2 U2.63(~{WE}) ; port MCU_Parallel_Mem_Bus.~WE

Not connected (* = marked no-connect by the designer): U2 48(H_VDD)

### Notes on the sheet
- Подп. и дата
- Инв. № дубл.
- Взам. инв. №
- Инв. № подл.
- Изм.
- Лист
- № докум.
- Подп.
- Дата
- Форма 2а ГОСТ 2.104-2006
- Копировал
- Формат А4

### Library data of the parts
C20-C27 = Capacitor: as C1 on sheet dv_mcu_mcu
R33 R34 = Resistor: as R1 on sheet dv_mcu
U2 = 1645RT2U: Микросхема однократно программируемого постоянного / запоминающего устройства ёмкостью 256 К с организацией 32Кх8 / 1645РТ2У; Назначение: ОППЗУ; Потребление, Вт: 0.330; ComponentLink1Description: DataSheet; ComponentLink1URL: https://forum.milandr.ru/download/file.php?id=473
U3-U7 = FM25V: 2Mb Serial 3V FRAM Memory; Потребление, Вт: 0,009; Назначение: 2Mb Serial 3V FRAM Memory; ComponentLink1Description: Datasheet; ComponentLink1URL: https://www.cypress.com/file/136456/download; Наименование: FM25V20

## Sheet dv_mcu_mpi_driver.SchDoc: =GlobalProjectName
size 209 x 297 mm; ApprovedBy: Утвердил; CheckedBy: Проверил; Author: Разработал; Organization: НГУ; DocumentNumber: ЮМП.250.270.042.02 Э3; Revision: #1.0; SheetNumber: 5; SheetTotal: 6; PageSetup: Record=PageOptions|CenterHorizontal=True|CenterVertical=True|PrintScale=1.00|XCorrection=1.00|YCorrection=1.00|PrintKind=1|BorderSize=5000000|LeftOffset=0|BottomOffset=0|Orientation=2|PaperLength=1000|PaperWidth=1000|Scale=100|PaperSource=15|PrintQuality=1200|MediaType=1|DitherType=10|PaperKind=A3|PrintScaleMode=1; Weight: -; ScaleFactor: -; NormInspection: Норм.Контр.; FirstApplication: ЮМП.250.270.042.02
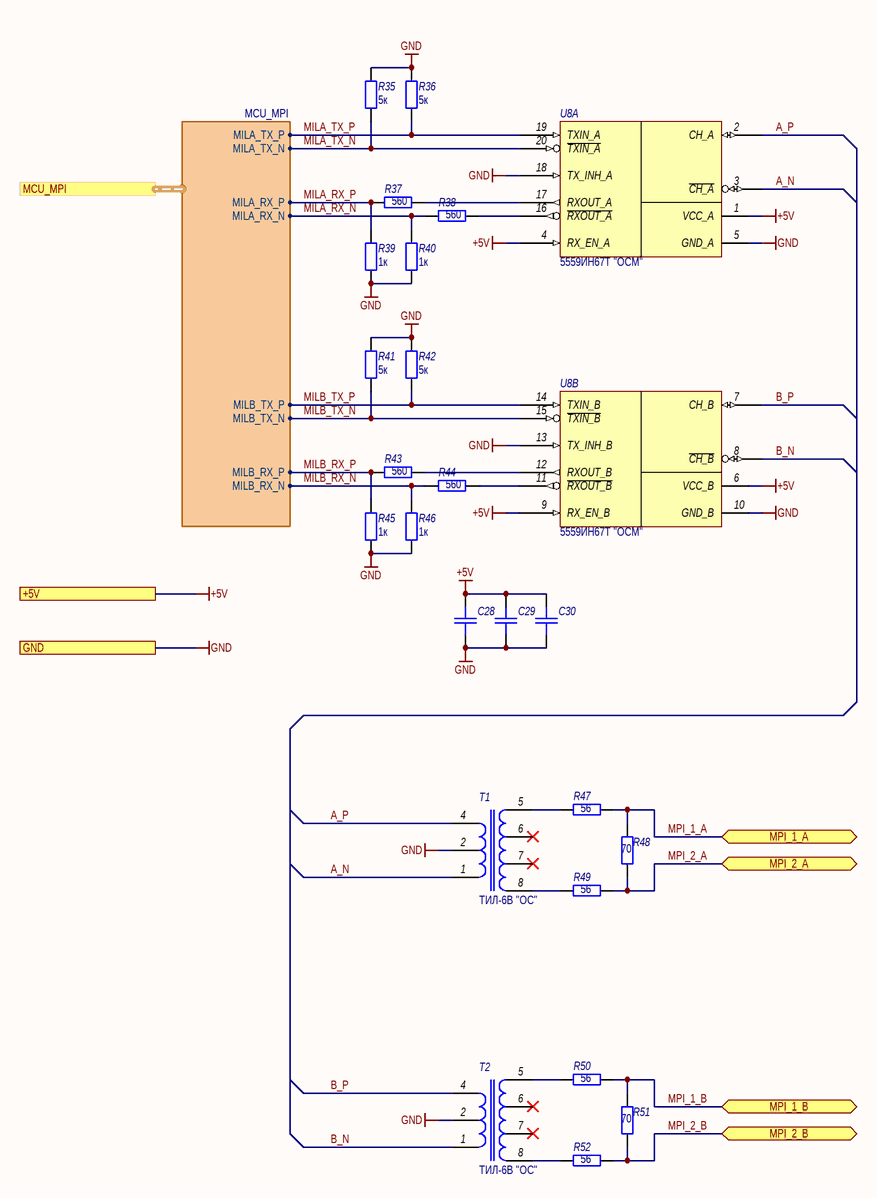
[diagram p4: dv_mcu_mpi_driver.SchDoc]

### Parts
C28  K10-79  [SMD_C0805]  (value not drawn)
C29  K10-79  [SMD_C0805]  (value not drawn)
C30  K10-79  [SMD_C0805]  (value not drawn)
R35  value 5к  [SMD_0805]
R36  value 5к  [SMD_0805]  (hidden comment: OSM R1-12)
R37  value 560  [SMD_0805]  (hidden comment: OSM R1-12)
R38  value 560  [SMD_0805]  (hidden comment: OSM R1-12)
R39  value 1к  [SMD_0805]  (hidden comment: OSM R1-12)
R40  value 1к  [SMD_0805]  (hidden comment: OSM R1-12)
R41  value 5к  [SMD_0805]  (hidden comment: OSM R1-12)
R42  value 5к  [SMD_0805]  (hidden comment: OSM R1-12)
R43  value 560  [SMD_0805]  (hidden comment: OSM R1-12)
R44  value 560  [SMD_0805]  (hidden comment: OSM R1-12)
R45  value 1к  [SMD_0805]  (hidden comment: OSM R1-12)
R46  value 1к  [SMD_0805]  (hidden comment: OSM R1-12)
R47  value 56  [SMD_0805]  (hidden comment: OSM R1-12)
R48  value 70  [SMD_0805]  (hidden comment: OSM R1-12)
R49  value 56  [SMD_0805]  (hidden comment: OSM R1-12)
R50  value 56  [SMD_0805]  (hidden comment: OSM R1-12)
R51  value 70  [SMD_0805]  (hidden comment: OSM R1-12)
R52  value 56  [SMD_0805]  (hidden comment: OSM R1-12)
T1  Наименование: ТИЛ-6В "ОС"  [TIL-6V]  (hidden comment: TIL-6V)
T2  Наименование: ТИЛ-6В "ОС"  [TIL-6V]  (hidden comment: TIL-6V)
U8  Наименование: 5559ИН67Т "ОСМ"  [4153.20-6]  (hidden comment: 5559IN67T_OSM)  (parts A,B of 2)

### Ports
+5V, GND, MCU_MPI (harness MCU_MPI), MPI_1_A (bidir), MPI_1_B (bidir), MPI_2_A (bidir), MPI_2_B (bidir)

### Harnesses
MCU_MPI: MILB_RX_N, MILB_RX_P, MILB_TX_P, MILB_TX_N, MILA_RX_N, MILA_RX_P, MILA_TX_P, MILA_TX_N

### Nets
+5V: C28.2 C29.2 C30.2 U8.1(VCC_A) U8.4(RX_EN_A) U8.6(VCC_B) U8.9(RX_EN_B) ; port +5V
GND: C28.1 C29.1 C30.1 R35.1 R36.1 R39.2 R40.2 R41.1 R42.1 R45.2 R46.2 T1.2 T2.2 U8.5(GND_A) U8.10(GND_B) U8.13(TX_INH_B) U8.18(TX_INH_A) ; port GND
A_N: T1.1 U8.3(~{CH_A})
A_P: T1.4 U8.2(CH_A)
B_N: T2.1 U8.8(~{CH_B})
B_P: T2.4 U8.7(CH_B)
MILA_RX_N: R38.1 R40.1 ; port MCU_MPI.MILA_RX_N
MILA_RX_P: R37.1 R39.1 ; port MCU_MPI.MILA_RX_P
MILA_TX_N: R35.2 U8.20(~{TXIN_A}) ; port MCU_MPI.MILA_TX_N
MILA_TX_P: R36.2 U8.19(TXIN_A) ; port MCU_MPI.MILA_TX_P
MILB_RX_N: R44.1 R46.1 ; port MCU_MPI.MILB_RX_N
MILB_RX_P: R43.1 R45.1 ; port MCU_MPI.MILB_RX_P
MILB_TX_N: R41.2 U8.15(~{TXIN_B}) ; port MCU_MPI.MILB_TX_N
MILB_TX_P: R42.2 U8.14(TXIN_B) ; port MCU_MPI.MILB_TX_P
MPI_1_A: R47.1 R48.1 ; port MPI_1_A
MPI_1_B: R50.1 R51.1 ; port MPI_1_B
MPI_2_A: R48.2 R49.1 ; port MPI_2_A
MPI_2_B: R51.2 R52.1 ; port MPI_2_B
NetR37_2: R37.2 U8.17(RXOUT_A)
NetR38_2: R38.2 U8.16(~{RXOUT_A})
NetR43_2: R43.2 U8.12(RXOUT_B)
NetR44_2: R44.2 U8.11(~{RXOUT_B})
NetR47_2: R47.2 T1.5
NetR49_2: R49.2 T1.8
NetR50_2: R50.2 T2.5
NetR52_2: R52.2 T2.8

Not connected (* = marked no-connect by the designer): T1 6* 7*; T2 6* 7*

### Notes on the sheet
- Подп. и дата
- Инв. № дубл.
- Взам. инв. №
- Инв. № подл.
- Изм.
- Лист
- № докум.
- Подп.
- Дата
- Форма 2а ГОСТ 2.104-2006
- Копировал
- Формат А4

### Library data of the parts
C28 C30 = Capacitor: Назначение: SMD-конденсатор; Наименование: К10-79; Потребление, Вт: 0; Value: 10мкФ; Напряжение: В; Точность: %
C29 = Capacitor: Назначение: SMD-конденсатор; Наименование: К10-79; Потребление, Вт: 0; Value: 0,1мкФ; Напряжение: В; Точность: %
R35-R52 = Resistor: as R1 on sheet dv_mcu
T1 T2 = TIL-6V: Импульсный трансформатор; Назначение: Импульсный трансформатор МПИ; Потребление, Вт: 0.0
U8 = 5559IN67T: Приемопередатчики манчестерского кода; Назначение: Приемопередатчик манчестерского кода; Потребление, Вт: 0.1; ComponentLink1Description: DataSheet; ComponentLink1URL: https://www.integral.by/sites/default/files/5559_IN67_68T.pdf

## Sheet dv_mcu_pwr.SchDoc: =GlobalProjectName
size 209 x 297 mm; ApprovedBy: Утвердил; CheckedBy: Проверил; Author: Разработал; Organization: НГУ; DocumentNumber: ЮМП.250.270.042.02 Э3; Revision: #1.0; SheetNumber: 6; SheetTotal: 6; PageSetup: Record=PageOptions|CenterHorizontal=True|CenterVertical=True|PrintScale=1.00|XCorrection=1.00|YCorrection=1.00|PrintKind=1|BorderSize=5000000|LeftOffset=0|BottomOffset=0|Orientation=2|PaperLength=1000|PaperWidth=1000|Scale=100|PaperSource=15|PrintQuality=1200|MediaType=1|DitherType=10|PaperKind=A3|PrintScaleMode=1; Weight: -; ScaleFactor: -; NormInspection: Норм.Контр.; FirstApplication: ЮМП.250.270.042.02
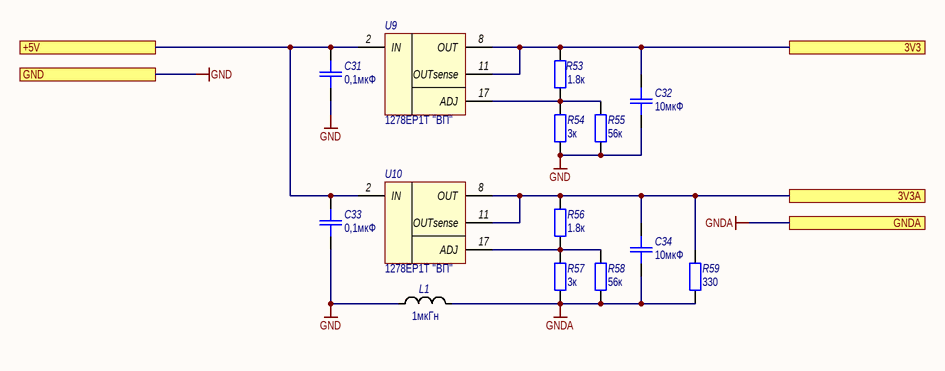
[diagram p5: dv_mcu_pwr.SchDoc]

### Parts
C31  value 0,1мкФ  [SMD_C0805]  (hidden comment: K10-79)
C32  value 10мкФ  [SMD_C0805]  (hidden comment: K10-79)
C33  value 0,1мкФ  [SMD_C0805]  (hidden comment: K10-79)
C34  value 10мкФ  [SMD_C0805]  (hidden comment: K10-79)
L1  1мкГн  [SMD_0805]
R53  value 1.8к  [SMD_0805]  (hidden comment: OSM R1-12)
R54  value 3к  [SMD_0805]  (hidden comment: OSM R1-12)
R55  value 56к  [SMD_0805]  (hidden comment: OSM R1-12)
R56  value 1.8к  [SMD_0805]  (hidden comment: OSM R1-12)
R57  value 3к  [SMD_0805]  (hidden comment: OSM R1-12)
R58  value 56к  [SMD_0805]  (hidden comment: OSM R1-12)
R59  value 330  [SMD_0805]  (hidden comment: OSM R1-12)
U9  Наименование: 1278ЕР1Т "ВП"  [4116.4-3_offcut]  (hidden comment: 1278ER1T VP)
U10  Наименование: 1278ЕР1Т "ВП"  [4116.4-3_offcut]  (hidden comment: 1278ER1T VP)

### Ports
3V3, 3V3A, +5V, GND, GNDA

### Nets
3V3: C32.2 R53.2 U9.8(OUT) U9.11(OUTsense) ; port 3V3
3V3A: C34.2 R56.2 R59.2 U10.8(OUT) U10.11(OUTsense) ; port 3V3A
+5V: C31.2 C33.2 U9.2(IN) U10.2(IN) ; port +5V
GND: C31.1 C32.1 C33.1 C34.1 L1.1 L1.2 R54.1 R55.1 R57.1 R58.1 R59.1 ; port GND, port GNDA  [also labelled GNDA]
NetR53_1: R53.1 R54.2 R55.2 U9.17(ADJ)
NetR56_1: R56.1 R57.2 R58.2 U10.17(ADJ)

### Notes on the sheet
- Подп. и дата
- Инв. № дубл.
- Взам. инв. №
- Инв. № подл.
- Изм.
- Лист
- № докум.
- Подп.
- Дата
- Форма 2а ГОСТ 2.104-2006
- Копировал
- Формат А4

### Library data of the parts
C31-C34 = Capacitor: as C1 on sheet dv_mcu_mcu
L1 = Inductor: Наименование: Индуктивность; Назначение: SMD-индуктивность; Потребление, Вт: 0,010; Value: 1мкГн
R53-R59 = Resistor: as R1 on sheet dv_mcu
U9 U10 = 1278ER1T: Low-drop linear regulator; Назначение: Линейный регулятор; Потребление, Вт: 0,100; ComponentLink1Description: DataSheet; ComponentLink1URL: https://www.radiant.su/files/images/Kremhij-marketing/1278EP1T.pdf

## Nets that join several sheets
3V3: dv_mcu (X3.9 X3.10), dv_mcu_mcu (50 pins), dv_mcu_mem (31 pins), dv_mcu_pwr (C32.2 R53.2 U9.8 U9.11)
3V3A: dv_mcu (X2.25 X2.26), dv_mcu_mcu (C17.2 C18.2 U1.108 U1.126), dv_mcu_pwr (5 pins)
+5V: dv_mcu (R1.1 R2.1), dv_mcu_mpi_driver (7 pins), dv_mcu_pwr (C31.2 C33.2 U9.2 U10.2)
GND: dv_mcu (18 pins), dv_mcu_mcu (59 pins), MCU/LPF_ADC0 (C19_LPF_ADC0.1), MCU/LPF_ADC1 (C19_LPF_ADC1.1), MCU/LPF_ADC2 (C19_LPF_ADC2.1), MCU/LPF_ADC3 (C19_LPF_ADC3.1), MCU/LPF_ADC4 (C19_LPF_ADC4.1), MCU/LPF_ADC5 (C19_LPF_ADC5.1), MCU/LPF_ADC6 (C19_LPF_ADC6.1), MCU/LPF_ADC7 (C19_LPF_ADC7.1), MCU/LPF_ADC8 (C19_LPF_ADC8.1), MCU/LPF_ADC9 (C19_LPF_ADC9.1), MCU/LPF_ADC10 (C19_LPF_ADC10.1), MCU/LPF_ADC11 (C19_LPF_ADC11.1), MCU/LPF_ADC12 (C19_LPF_ADC12.1), MCU/LPF_ADC13 (C19_LPF_ADC13.1), dv_mcu_mem (26 pins), dv_mcu_mpi_driver (17 pins), dv_mcu_pwr (11 pins)
A_0: dv_mcu_mcu (U1.90), dv_mcu_mem (U2.2)
A_1: dv_mcu_mcu (U1.89), dv_mcu_mem (U2.3)
A_2: dv_mcu_mcu (U1.88), dv_mcu_mem (U2.4)
A_3: dv_mcu_mcu (U1.86), dv_mcu_mem (U2.5)
A_4: dv_mcu_mcu (U1.85), dv_mcu_mem (U2.6)
A_5: dv_mcu_mcu (U1.84), dv_mcu_mem (U2.7)
A_6: dv_mcu_mcu (U1.83), dv_mcu_mem (U2.8)
A_7: dv_mcu_mcu (U1.82), dv_mcu_mem (U2.19)
A_8: dv_mcu_mcu (U1.80), dv_mcu_mem (U2.20)
A_9: dv_mcu_mcu (U1.79), dv_mcu_mem (U2.21)
A_10: dv_mcu_mcu (U1.78), dv_mcu_mem (U2.45)
A_11: dv_mcu_mcu (R27.1 U1.77), dv_mcu_mem (U2.59)
A_12: dv_mcu_mcu (R26.1 U1.76), dv_mcu_mem (U2.60)
A_13: dv_mcu_mcu (R25.1 U1.74), dv_mcu_mem (U2.61)
A_14: dv_mcu_mcu (R23.1 R24.1 U1.73), dv_mcu_mem (U2.62)
ADC_0: dv_mcu (X2.19), MCU/LPF_ADC0 (R32_LPF_ADC0.1)
ADC_1: dv_mcu (X2.20), MCU/LPF_ADC1 (R32_LPF_ADC1.1)
ADC_2: dv_mcu (X2.17), MCU/LPF_ADC2 (R32_LPF_ADC2.1)
ADC_3: dv_mcu (X2.18), MCU/LPF_ADC3 (R32_LPF_ADC3.1)
ADC_4: dv_mcu (X2.15), MCU/LPF_ADC4 (R32_LPF_ADC4.1)
ADC_5: dv_mcu (X2.16), MCU/LPF_ADC5 (R32_LPF_ADC5.1)
ADC_6: dv_mcu (X2.13), MCU/LPF_ADC6 (R32_LPF_ADC6.1)
ADC_7: dv_mcu (X2.14), MCU/LPF_ADC7 (R32_LPF_ADC7.1)
ADC_8: dv_mcu (X2.11), MCU/LPF_ADC8 (R32_LPF_ADC8.1)
ADC_9: dv_mcu (X2.12), MCU/LPF_ADC9 (R32_LPF_ADC9.1)
ADC_10: dv_mcu (X2.9), MCU/LPF_ADC10 (R32_LPF_ADC10.1)
ADC_11: dv_mcu (X2.10), MCU/LPF_ADC11 (R32_LPF_ADC11.1)
ADC_12: dv_mcu (X2.7), MCU/LPF_ADC12 (R32_LPF_ADC12.1)
ADC_13: dv_mcu (X2.8), MCU/LPF_ADC13 (R32_LPF_ADC13.1)
ADC_IN_0: dv_mcu_mcu (U1.122), MCU/LPF_ADC0 (C19_LPF_ADC0.2 R32_LPF_ADC0.2)
ADC_IN_1: dv_mcu_mcu (U1.121), MCU/LPF_ADC1 (C19_LPF_ADC1.2 R32_LPF_ADC1.2)
ADC_IN_2: dv_mcu_mcu (U1.120), MCU/LPF_ADC2 (C19_LPF_ADC2.2 R32_LPF_ADC2.2)
ADC_IN_3: dv_mcu_mcu (U1.117), MCU/LPF_ADC3 (C19_LPF_ADC3.2 R32_LPF_ADC3.2)
ADC_IN_4: dv_mcu_mcu (U1.116), MCU/LPF_ADC4 (C19_LPF_ADC4.2 R32_LPF_ADC4.2)
ADC_IN_5: dv_mcu_mcu (U1.115), MCU/LPF_ADC5 (C19_LPF_ADC5.2 R32_LPF_ADC5.2)
ADC_IN_6: dv_mcu_mcu (U1.114), MCU/LPF_ADC6 (C19_LPF_ADC6.2 R32_LPF_ADC6.2)
ADC_IN_7: dv_mcu_mcu (U1.112), MCU/LPF_ADC7 (C19_LPF_ADC7.2 R32_LPF_ADC7.2)
ADC_IN_8: dv_mcu_mcu (U1.111), MCU/LPF_ADC8 (C19_LPF_ADC8.2 R32_LPF_ADC8.2)
ADC_IN_9: dv_mcu_mcu (U1.110), MCU/LPF_ADC9 (C19_LPF_ADC9.2 R32_LPF_ADC9.2)
ADC_IN_10: dv_mcu_mcu (U1.109), MCU/LPF_ADC10 (C19_LPF_ADC10.2 R32_LPF_ADC10.2)
ADC_IN_11: dv_mcu_mcu (U1.107), MCU/LPF_ADC11 (C19_LPF_ADC11.2 R32_LPF_ADC11.2)
ADC_IN_12: dv_mcu_mcu (U1.106), MCU/LPF_ADC12 (C19_LPF_ADC12.2 R32_LPF_ADC12.2)
ADC_IN_13: dv_mcu_mcu (U1.105), MCU/LPF_ADC13 (C19_LPF_ADC13.2 R32_LPF_ADC13.2)
D_0: dv_mcu_mcu (U1.46), dv_mcu_mem (U2.29)
D_1: dv_mcu_mcu (U1.45), dv_mcu_mem (U2.30)
D_2: dv_mcu_mcu (U1.44), dv_mcu_mem (U2.31)
D_3: dv_mcu_mcu (U1.43), dv_mcu_mem (U2.34)
D_4: dv_mcu_mcu (U1.42), dv_mcu_mem (U2.35)
D_5: dv_mcu_mcu (U1.41), dv_mcu_mem (U2.36)
D_6: dv_mcu_mcu (U1.40), dv_mcu_mem (U2.37)
D_7: dv_mcu_mcu (U1.39), dv_mcu_mem (U2.38)
GPIO_0: dv_mcu (R10.1), dv_mcu_mcu (U1.26)
GPIO_1: dv_mcu (R3.2), dv_mcu_mcu (U1.19)
MILA_RX_N: dv_mcu_mcu (U1.209), dv_mcu_mpi_driver (R38.1 R40.1)
MILA_RX_P: dv_mcu_mcu (U1.210), dv_mcu_mpi_driver (R37.1 R39.1)
MILA_TX_N: dv_mcu_mcu (U1.214), dv_mcu_mpi_driver (R35.2 U8.20)
MILA_TX_P: dv_mcu_mcu (U1.212), dv_mcu_mpi_driver (R36.2 U8.19)
MILB_RX_N: dv_mcu_mcu (U1.185), dv_mcu_mpi_driver (R44.1 R46.1)
MILB_RX_P: dv_mcu_mcu (U1.186), dv_mcu_mpi_driver (R43.1 R45.1)
MILB_TX_N: dv_mcu_mcu (U1.190), dv_mcu_mpi_driver (R41.2 U8.15)
MILB_TX_P: dv_mcu_mcu (U1.188), dv_mcu_mpi_driver (R42.2 U8.14)
MISO: dv_mcu_mcu (U1.239), dv_mcu_mem (5 pins)
MOSI: dv_mcu_mcu (U1.242), dv_mcu_mem (5 pins)
MPI_1_A: dv_mcu (X1.19 X1.20), dv_mcu_mpi_driver (R47.1 R48.1)
MPI_1_B: dv_mcu (X1.15 X1.16), dv_mcu_mpi_driver (R50.1 R51.1)
MPI_2_A: dv_mcu (X1.17 X1.18), dv_mcu_mpi_driver (R48.2 R49.1)
MPI_2_B: dv_mcu (X1.13 X1.14), dv_mcu_mpi_driver (R51.2 R52.1)
MPI_ADDR_0: dv_mcu (R4.2), dv_mcu_mcu (U1.171)
MPI_ADDR_1: dv_mcu (R5.2), dv_mcu_mcu (U1.172)
MPI_ADDR_2: dv_mcu (R6.2), dv_mcu_mcu (U1.179)
MPI_ADDR_3: dv_mcu (R7.2), dv_mcu_mcu (U1.180)
MPI_ADDR_4: dv_mcu (R8.2), dv_mcu_mcu (U1.181)
MPI_ADDR_EVEN: dv_mcu (R9.2), dv_mcu_mcu (U1.182)
NRST: dv_mcu (X3.1), dv_mcu_mcu (R13.1 U1.1 U1.3)
SCK: dv_mcu_mcu (U1.241), dv_mcu_mem (5 pins)
SWCLK: dv_mcu (X3.2), dv_mcu_mcu (U1.250)
SWDIO: dv_mcu (X3.4), dv_mcu_mcu (U1.248)
SWDO: dv_mcu (X3.6), dv_mcu_mcu (U1.246)
UART_RX_DBG: dv_mcu (X3.12), dv_mcu_mcu (U1.164)
UART_TX_DBG: dv_mcu (X3.11), dv_mcu_mcu (U1.165)
~CS_0: dv_mcu_mcu (U1.57), dv_mcu_mem (R34.2 U2.44)
~FS_0: dv_mcu_mcu (U1.240), dv_mcu_mem (U3.1)
~FS_1: dv_mcu_mcu (U1.236), dv_mcu_mem (U4.1)
~FS_2: dv_mcu_mcu (U1.235), dv_mcu_mem (U5.1)
~FS_3: dv_mcu_mcu (U1.234), dv_mcu_mem (U6.1)
~FS_4: dv_mcu_mcu (U1.231), dv_mcu_mem (U7.1)
~OE: dv_mcu_mcu (U1.53), dv_mcu_mem (U2.58)
~WE: dv_mcu_mcu (U1.52), dv_mcu_mem (R33.2 U2.63)